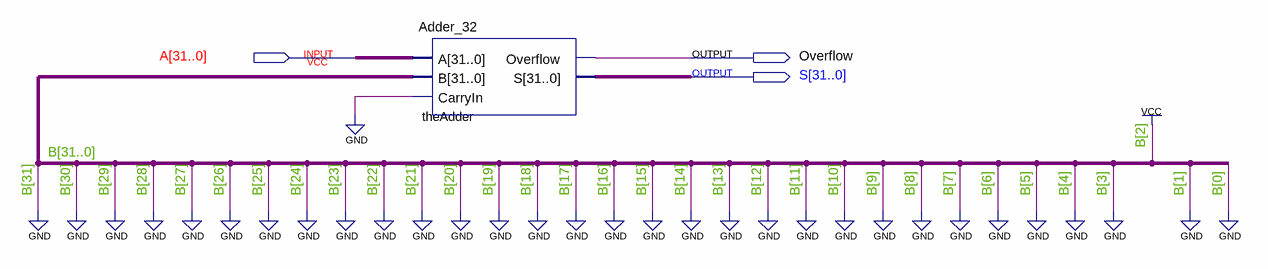
[diagram p0: schematic sheet]
// Quartus schematic INC4_32.bdf as structural Verilog: 1 symbols, 3 pins
module INC4_32 (
  input  [31:0] A,
  output Overflow,
  output [31:0] S
);

  Adder_32 theAdder (.A(A), .B(32'b00000000000000000000000000000100), .CarryIn(1'b0), .Overflow(Overflow), .S(S));
endmodule
